# Altium schematic sheet MCU.SchDoc
size 420 x 297 mm; Scale: 1:1; DocumentType: Схема электрическая принципиальная; FirstReferrence: АБВГ.123456.001
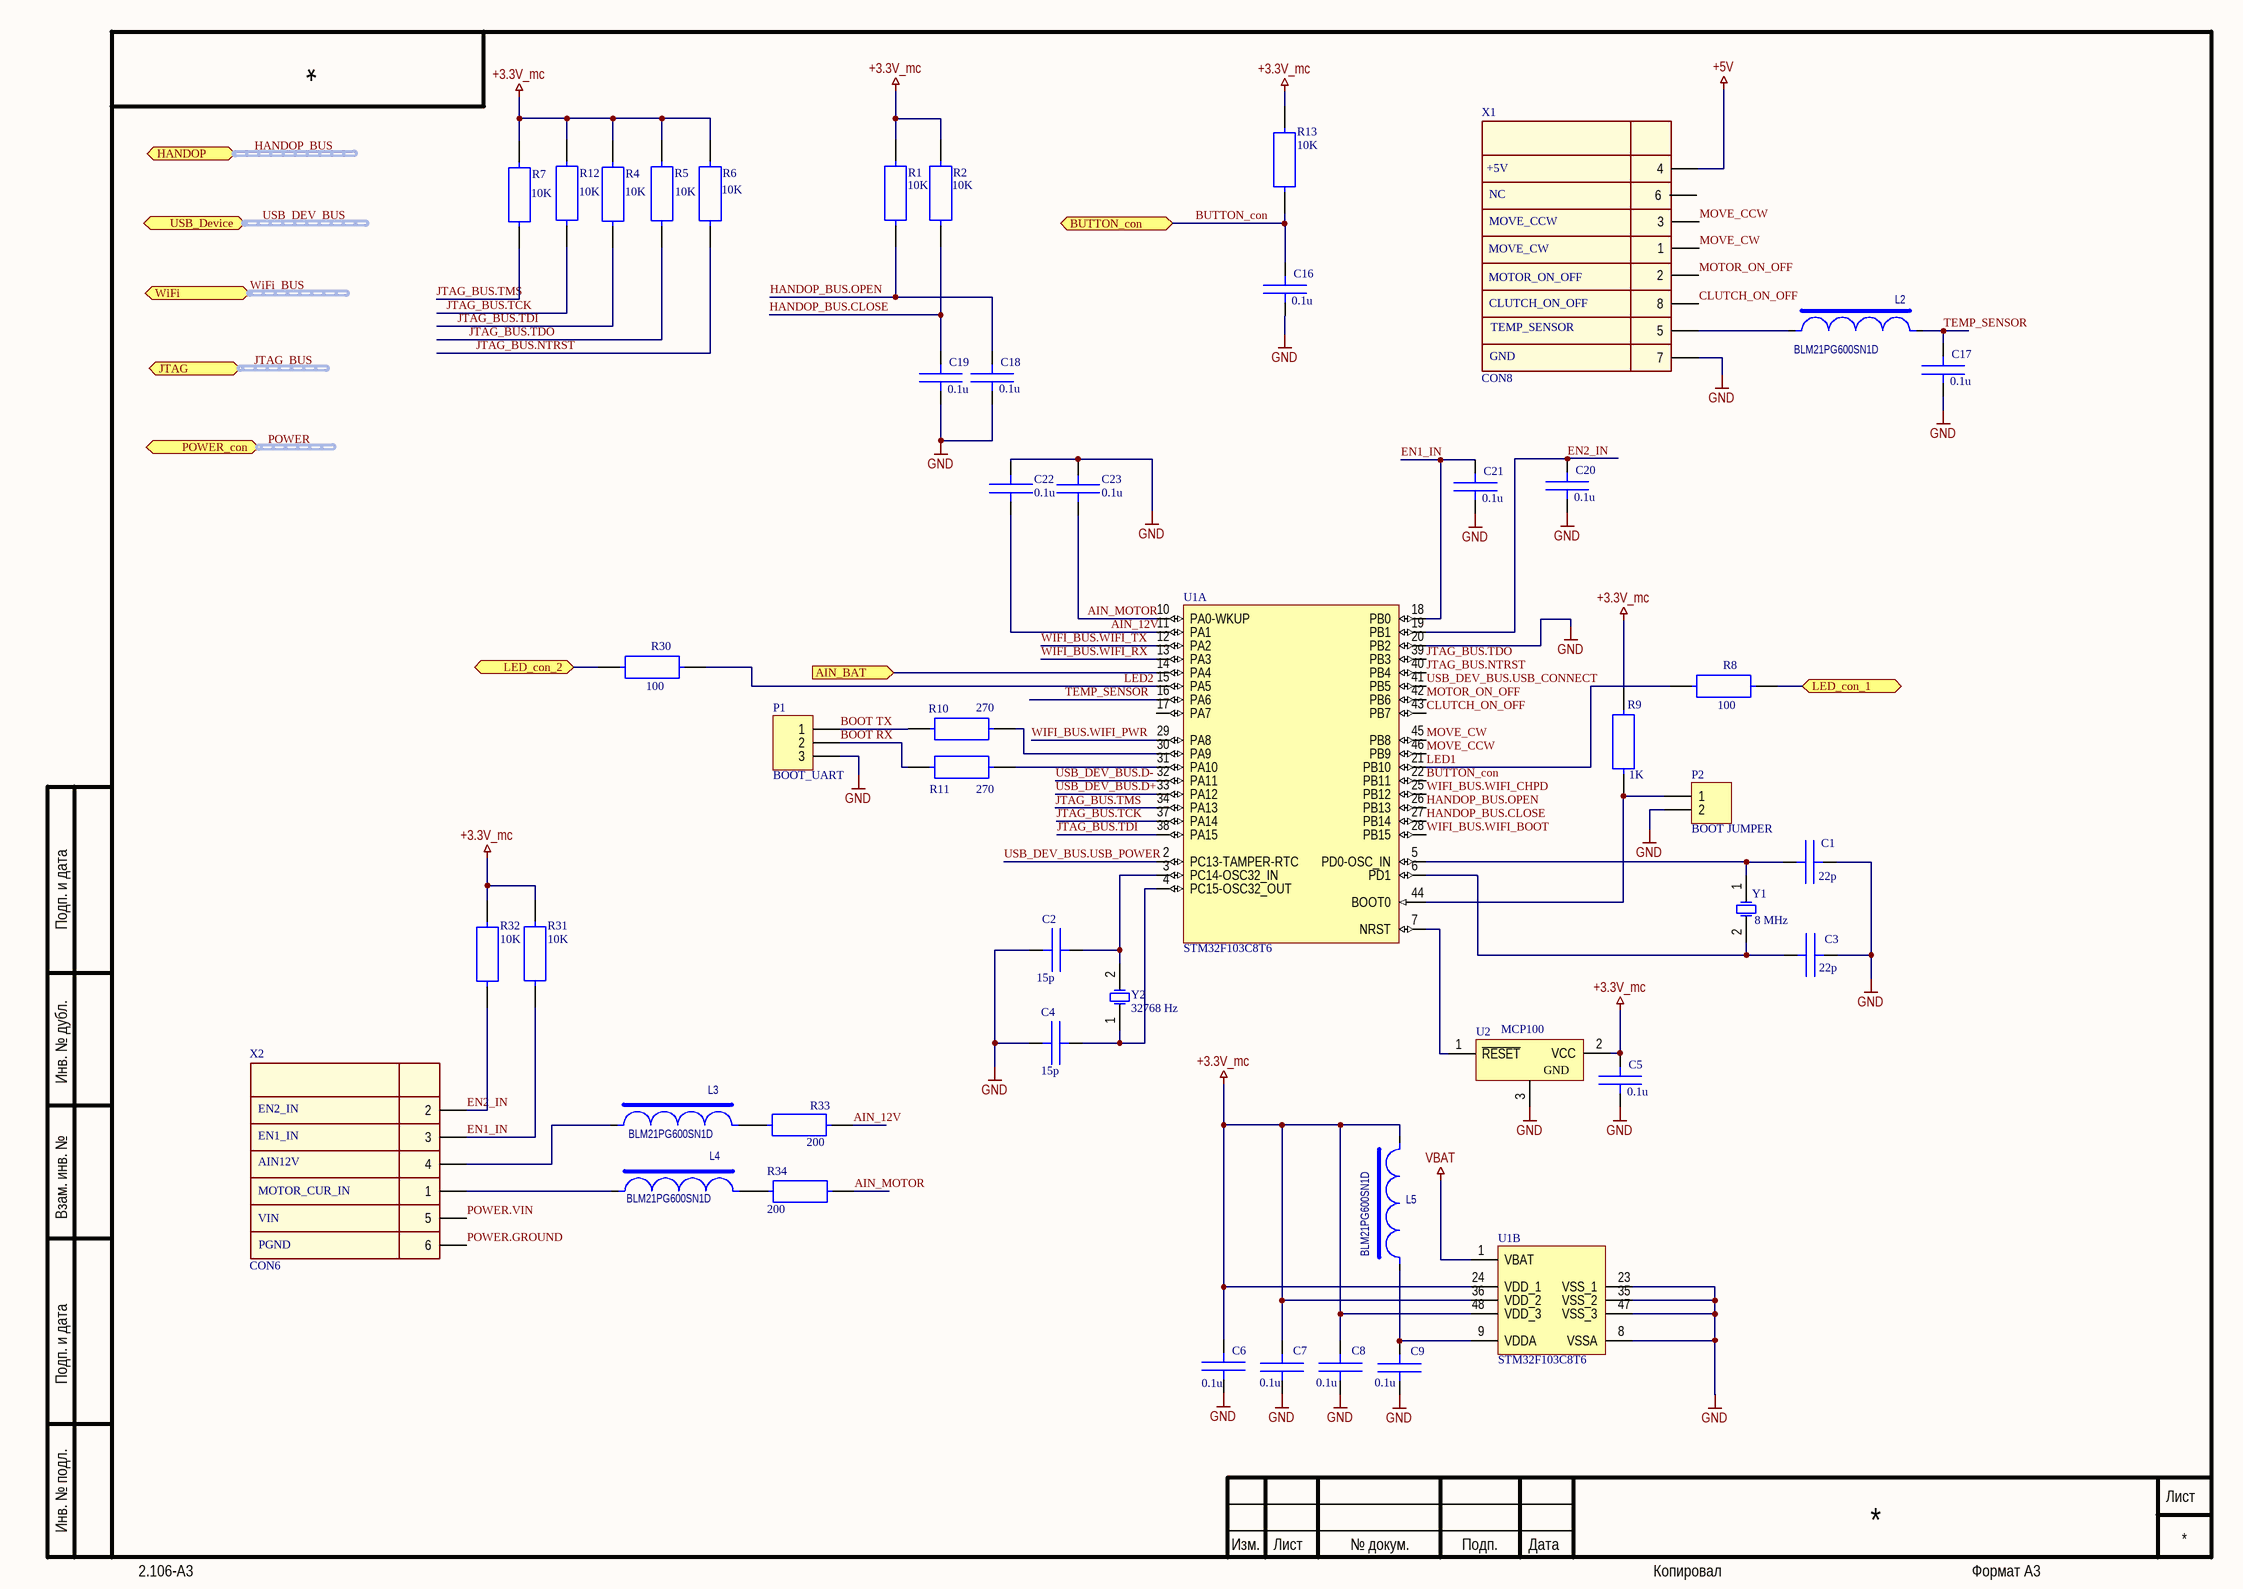
[diagram p0: MCU.SchDoc]

## Parts
C1  22p  [0603C]
C2  15p  [0603C]
C3  22p  [0603C]
C4  15p  [0603C]
C5  0.1u  [0603C]
C6  0.1u  [0603C]
C7  0.1u  [0603C]
C8  0.1u  [0603C]
C9  0.1u  [0603C]
C16  0.1u  [0603C]
C17  0.1u  [0603C]
C18  0.1u  [0603C]
C19  0.1u  [0603C]
C20  0.1u  [0603C]
C21  0.1u  [0603C]
C22  0.1u  [0603C]
C23  0.1u  [0603C]
L2  BLM21PG600SN1D  [0805]
L3  BLM21PG600SN1D  [0805]
L4  BLM21PG600SN1D  [0805]
L5  BLM21PG600SN1D  [0805]
P1  BOOT_UART  [HDR1X3]
P2  BOOT JUMPER  [HDR1X2]
R1  10K  [0603R]
R2  10K  [0603R]
R4  10K  [0603R]
R5  10K  [0603R]
R6  10K  [0603R]
R7  10K  [0603R]
R8  100  [0603R]
R9  1K  [0603R]
R10  270  [0603R]
R11  270  [0603R]
R12  10K  [0603R]
R13  10K  [0603R]
R30  100  [0603R]
R31  10K  [0603R]
R32  10K  [0603R]
R33  200  [0603R]
R34  200  [0603R]
U1  STM32F103C8T6  [LQFP48_L]  (parts A,B of 2)
U2  MCP100  [SOT95P230X110-3L]
X1  CON8  [HDR2X4_CEN]
X2  CON6  [HDR2X3_CEN]
Y1  8 MHz  [HC49(CRYSTAL)]
Y2  32768 Hz  [XTAL 32kHz -1]

## Ports
AIN_BAT (in), BUTTON_con, HANDOP (harness HANDOP_connector), JTAG (harness JTAG_connector), LED_con_1, LED_con_2, POWER_con (harness POWER), USB_Device (harness USB), WiFi (harness WiFi)

## Nets
+3.3V_mc: C5.2 C6.2 C7.2 C8.2 L5.2 R1.2 R2.2 R4.2 R5.2 R6.2 R7.2 R9.2 R12.2 R13.2 R31.1 R32.1 U1.24(VDD_1) U1.36(VDD_2) U1.48(VDD_3) U2.2(VСС)
+5V: X1.4
GND: C1.1 C2.1 C3.1 C4.1 C5.1 C6.1 C7.1 C8.1 C9.1 C16.1 C17.1 C18.1 C19.1 C20.1 C21.1 C22.1 C23.1 P1.3 P2.2 U1.8(VSSA) U1.20(PB2) U1.23(VSS_1) U1.35(VSS_2) U1.47(VSS_3) U2.3(GND) X1.7
VBAT: U1.1(VBAT)
AIN_12V: C22.2 R33.2 U1.11(PA1)
AIN_BAT: U1.14(PA4) ; port AIN_BAT
AIN_MOTOR: C23.2 R34.2 U1.10(PA0-WKUP)
BOOT RX: P1.2 R11.1
BOOT TX: P1.1 R10.1
BUTTON_con: C16.2 R13.1 U1.22(PB11) ; port BUTTON_con
CLUTCH_ON_OFF: U1.43(PB7) X1.8
EN1_IN: C21.2 R31.2 U1.18(PB0) X2.3
EN2_IN: C20.2 R32.2 U1.19(PB1) X2.2
HANDOP_BUS.CLOSE: C19.2 R2.1 U1.27(PB14)
HANDOP_BUS.OPEN: C18.2 R1.1 U1.26(PB13)
JTAG_BUS.NTRST: R6.1 U1.40(PB4)
JTAG_BUS.TCK: R12.1 U1.37(PA14)
JTAG_BUS.TDI: R4.1 U1.38(PA15)
JTAG_BUS.TDO: R5.1 U1.39(PB3)
JTAG_BUS.TMS: R7.1 U1.34(PA13)
LED1: R8.2 U1.21(PB10)
LED2: R30.1 U1.15(PA5)
LED_con_1: R8.1 ; port LED_con_1
LED_con_2: R30.2 ; port LED_con_2
MOTOR_ON_OFF: U1.42(PB6) X1.2
MOVE_CCW: U1.46(PB9) X1.3
MOVE_CW: U1.45(PB8) X1.1
POWER.GROUND: X2.6
POWER.VIN: X2.5
TEMP_SENSOR: C17.2 L2.2 U1.16(PA6)
USB_DEV_BUS.D+: U1.33(PA12)
USB_DEV_BUS.D-: U1.32(PA11)
USB_DEV_BUS.USB_CONNECT: U1.41(PB5)
USB_DEV_BUS.USB_POWER: U1.2(PC13-TAMPER-RTC)
WIFI_BUS.WIFI_BOOT: U1.28(PB15)
WIFI_BUS.WIFI_CHPD: U1.25(PB12)
WIFI_BUS.WIFI_PWR: U1.29(PA8)
WIFI_BUS.WIFI_RX: U1.13(PA3)
WIFI_BUS.WIFI_TX: U1.12(PA2)
NetC1_2: C1.2 U1.5(PD0-OSC_IN) Y1.1(OSC1)
NetC2_2: C2.2 U1.3(PC14-OSC32_IN) Y2.2(OSC2)
NetC3_2: C3.2 U1.6(PD1) Y1.2(OSC2)
NetC4_2: C4.2 U1.4(PC15-OSC32_OUT) Y2.1(OSC1)
NetC9_2: C9.2 L5.1 U1.9(VDDA)
NetL2_1: L2.1 X1.5
NetL3_1: L3.1 X2.4
NetL3_2: L3.2 R33.1
NetL4_1: L4.1 X2.1
NetL4_2: L4.2 R34.1
NetP2_1: P2.1 R9.1 U1.44(BOOT0)
NetR10_2: R10.2 U1.30(PA9)
NetR11_2: R11.2 U1.31(PA10)
NetU1_7: U1.7(NRST) U2.1(~{RESET})

Not connected (* = marked no-connect by the designer): U1 17(PA7); X1 6

## Buses and harness runs
harness HANDOP_BUS = port HANDOP
harness JTAG_BUS = port JTAG
harness POWER = port POWER_con
harness USB_DEV_BUS = port USB_Device
harness WiFi_BUS = port WiFi

## Notes on the sheet
- +5V
- MOVE_CW
- MOVE_CCW
- NC
- MOTOR_ON_OFF
- CLUTCH_ON_OFF
- GND
- TEMP_SENSOR
- EN1_IN
- EN2_IN
- MOTOR_CUR_IN
- AIN12V
- VIN
- PGND
- Подп. и дата
- Инв. № дубл.
- Взам. инв. №
- Инв. № подл.
- Изм.
- Лист
- № докум.
- Подп.
- Дата
- 2.106-A3
- Копировал
- Формат А3

## Library data of the parts
C1-C9 C16-C23 = CAP: Конденсатор обыкновенный
  C1 C3: Value: 22p
  C2 C4: Value: 15p
  C5-C9 C16-C23: Value: 0.1u
L2-L5 = INDUCTOR_: Индуктивность
P1 = Header 3: Header, 3-Pin; LatestRevisionDate: 17-Jul-2002; LatestRevisionNote: Re-released for DXP Platform.; Publisher: Altium Limited
P2 = Header 2: Header, 2-Pin; LatestRevisionDate: 17-Jul-2002; LatestRevisionNote: Re-released for DXP Platform.; Publisher: Altium Limited
R1 R2 R4-R13 R30-R34 = RES: Резистор обыкновенный
  R1 R2 R4-R7 R12 R13 R31 R32: Value: 10K
  R8 R30: Value: 100
  R9: Value: 1K
  R10 R11: Value: 270
  R33 R34: Value: 200
U1 = STM32F103C8T6: STM32 ARM-based 32-bit MCU Performance Line with 64 kB Flash, 20 kB Internal RAM, -40 to +85°C Temperature, 48-Pin LQFP, Tray; DatasheetVersion: rev13.0, Apr-2011; PackageVersion: rev13, Apr-2011; PackageReference: LQFP48; PackageDescription: 48-Pin Low-Profile Quad Flat Pack, 7 x 7 mm Body, 0.5 mm Pitch (LQFP48); ComponentLink1Description: Manufacturer URL; ComponentLink1URL: http://www.st.com/; ComponentLink2Description: STM32F103 Datasheet; ComponentLink2URL: http://www.st.com/internet/com/TECHNICAL_RESOURCES/TECHNICAL_LITERATURE/DATASHEET/CD00161566.pdf; ComponentLink3Description: STM32 Family Web Page; ComponentLink3URL: www.st.com/stm32
U2 = RESET_CIRCUIT: RESET CIRCUIT
X1 = CON8: штыри(папа)
X2 = CON6: штыри(папа)
Y1 Y2 = XTAL: Crystal Oscillator; Published: 8-Jun-2000; LatestRevisionDate: 17-Jul-2002; LatestRevisionNote: Re-released for DXP Platform.; PackageReference: R38; Publisher: Altium Limited; PackageDescription: Crystal, Thru-Hole; 2 Leads; Body 3.1 x 8.2 mm (Dia.xH)